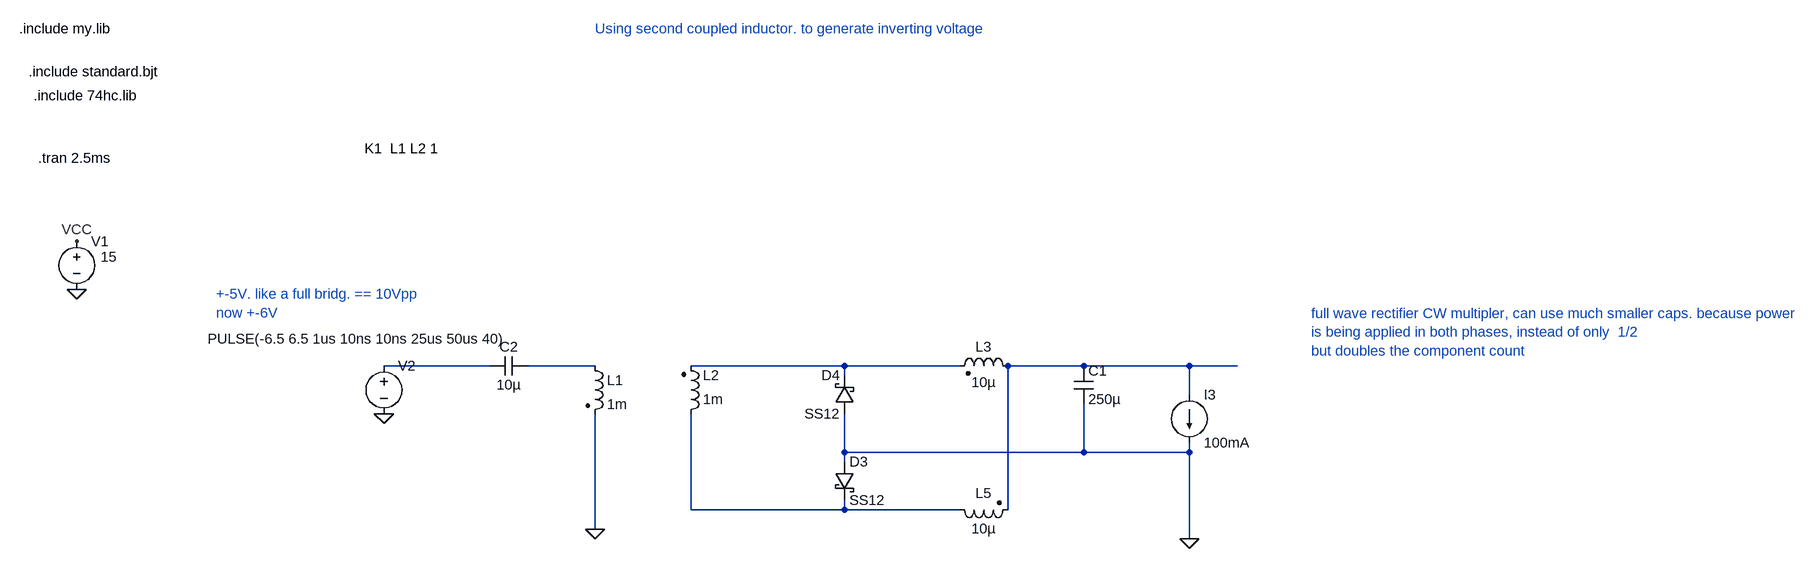
[diagram p0: schematic Draft30.asc]
Draft30.asc, the LTspice schematic file:
Version 4
SHEET 1 5720 1740
WIRE 1328 -128 1152 -128
WIRE 1504 -128 1392 -128
WIRE 1920 -128 1664 -128
WIRE 2112 -128 1920 -128
WIRE 2512 -128 2192 -128
WIRE 2688 -128 2512 -128
WIRE 2768 -128 2688 -128
WIRE 1920 -112 1920 -128
WIRE 2688 -80 2688 -128
WIRE 1920 16 1920 -48
WIRE 2512 16 2512 -64
WIRE 2512 16 1920 16
WIRE 2688 16 2688 0
WIRE 2688 16 2512 16
WIRE 1920 32 1920 16
WIRE 1664 112 1664 -48
WIRE 1920 112 1920 96
WIRE 1920 112 1664 112
WIRE 2112 112 1920 112
WIRE 2192 112 2192 -128
WIRE 1504 144 1504 -48
WIRE 2688 160 2688 16
FLAG 640 -256 0
FLAG 640 -336 VCC
FLAG 1152 -48 0
FLAG 1504 144 0
FLAG 2688 160 0
SYMBOL voltage 640 -352 R0
WINDOW 123 0 0 Left 0
WINDOW 39 0 0 Left 0
WINDOW 3 40 42 Left 2
SYMATTR Value 15
SYMATTR InstName V1
SYMBOL ind2 1488 -144 R0
SYMATTR InstName L1
SYMATTR Value 1m
SYMATTR Type ind
SYMBOL voltage 1152 -144 R0
WINDOW 123 0 0 Left 0
WINDOW 39 0 0 Left 0
WINDOW 3 -294 -29 Left 2
SYMATTR Value PULSE(-6.5 6.5 1us 10ns 10ns 25us 50us 40)
SYMATTR InstName V2
SYMBOL current 2688 -80 R0
WINDOW 123 0 0 Left 0
WINDOW 39 0 0 Left 0
SYMATTR InstName I3
SYMATTR Value 100mA
SYMBOL ind2 1648 -32 M180
WINDOW 0 36 80 Left 2
WINDOW 3 36 40 Left 2
SYMATTR InstName L2
SYMATTR Value 1m
SYMATTR Type ind
SYMBOL schottky 1936 -48 R180
WINDOW 0 24 64 Left 2
WINDOW 3 24 0 Left 2
SYMATTR InstName D4
SYMATTR Value SS12
SYMATTR Description Diode
SYMATTR Type diode
SYMBOL schottky 1904 32 R0
SYMATTR InstName D3
SYMATTR Value SS12
SYMATTR Description Diode
SYMATTR Type diode
SYMBOL cap 2496 -128 R0
SYMATTR InstName C1
SYMATTR Value 250µ
SYMBOL ind2 2208 -112 M270
WINDOW 0 32 56 VTop 2
WINDOW 3 4 56 VBottom 2
SYMATTR InstName L3
SYMATTR Value 10µ
SYMATTR Type ind
SYMBOL ind2 2096 96 M90
WINDOW 0 4 56 VBottom 2
WINDOW 3 32 56 VTop 2
SYMATTR InstName L5
SYMATTR Value 10µ
SYMATTR Type ind
SYMBOL cap 1392 -144 R90
WINDOW 0 0 32 VBottom 2
WINDOW 3 32 32 VTop 2
SYMATTR InstName C2
SYMATTR Value 10µ
TEXT 576 -480 Left 2 !.tran 2.5ms
TEXT 1120 -496 Left 2 !K1  L1 L2 1
TEXT 560 -624 Left 2 !.include standard.bjt
TEXT 544 -696 Left 2 !.include my.lib
TEXT 568 -584 Left 2 !.include 74hc.lib
TEXT 872 -248 Left 2 ;+-5V. like a full bridg. == 10Vpp\nnow +-6V
TEXT 3040 -216 Left 2 ;full wave rectifier CW multipler, can use much smaller caps. because power\nis being applied in both phases, instead of only  1/2\nbut doubles the component count
TEXT 1504 -696 Left 2 ;Using second coupled inductor. to generate inverting voltage

The netlist it stands for:
* Draft30.asc
V1 VCC 0 15
L1 N002 0 1m
V2 N001 0 PULSE(-6.5 6.5 1us 10ns 10ns 25us 50us 40)
I3 N004 0 100mA
L2 N005 N003 1m
D4 0 N003 SS12
D3 0 N005 SS12
C1 N004 0 250µ
L3 N004 N003 10µ
L5 N005 N004 10µ
C2 N002 N001 10µ
.model D D
.lib standard.dio
.tran 2.5ms
K1  L1 L2 1
.include standard.bjt
.include my.lib
.include 74hc.lib
* +-5V. like a full bridg. == 10Vpp
* now +-6V
* full wave rectifier CW multipler, can use much smaller caps. because power
* is being applied in both phases, instead of only  1/2
* but doubles the component count
* Using second coupled inductor. to generate inverting voltage
.backanno
.end